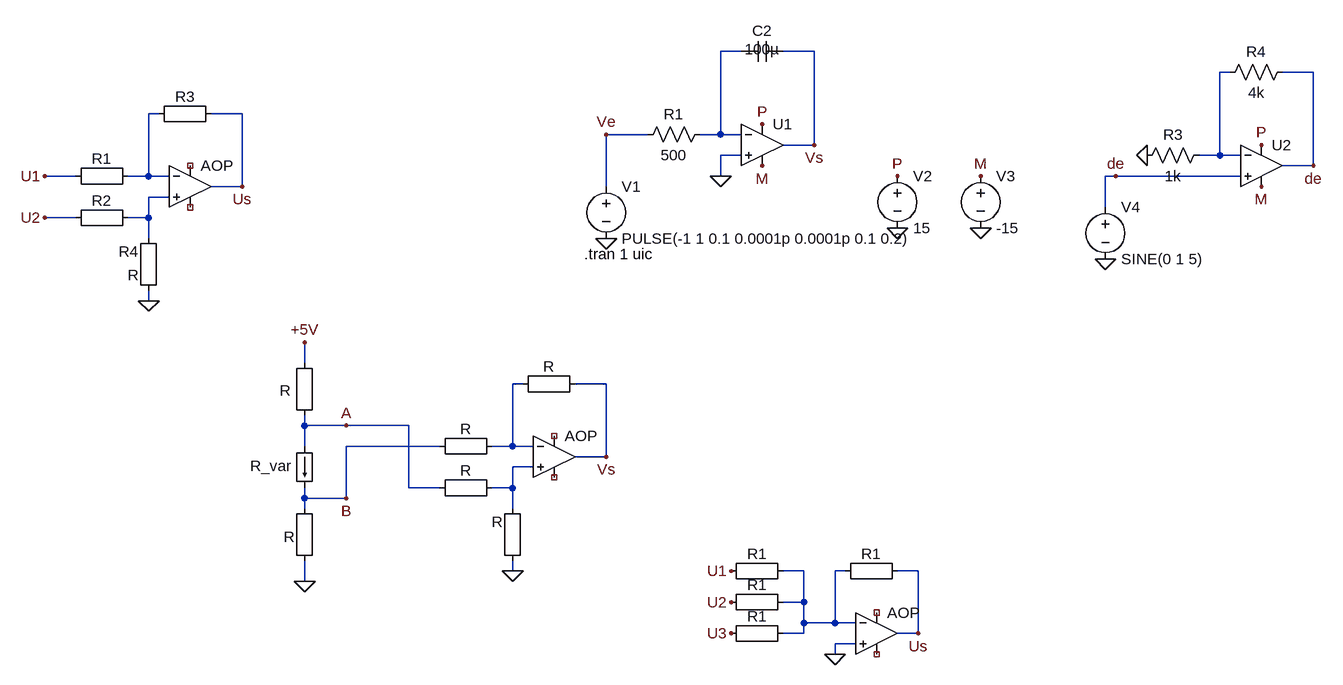
[diagram p0: schematic non_inv.asc]
non_inv.asc, the LTspice schematic file:
Version 4
SHEET 1 1008 908
WIRE 96 -48 64 -48
WIRE 208 -48 160 -48
WIRE 848 -16 832 -16
WIRE 976 -16 928 -16
WIRE -800 48 -816 48
WIRE -672 48 -720 48
WIRE -48 80 -112 80
WIRE 64 80 64 -48
WIRE 64 80 32 80
WIRE 96 80 64 80
WIRE 208 96 208 -48
WIRE 208 96 160 96
WIRE 96 112 64 112
WIRE 832 112 832 -16
WIRE 832 112 800 112
WIRE 864 112 832 112
WIRE 976 128 976 -16
WIRE 976 128 928 128
WIRE -928 144 -976 144
WIRE -816 144 -816 48
WIRE -816 144 -848 144
WIRE -784 144 -816 144
WIRE 64 144 64 112
WIRE 672 144 656 144
WIRE 864 144 672 144
WIRE -672 160 -672 48
WIRE -672 160 -720 160
WIRE -112 160 -112 80
WIRE -784 176 -816 176
WIRE 656 192 656 144
WIRE -928 208 -976 208
WIRE -816 208 -816 176
WIRE -816 208 -848 208
WIRE -816 240 -816 208
WIRE -816 336 -816 320
WIRE -576 432 -576 400
WIRE -240 464 -256 464
WIRE -112 464 -160 464
WIRE -576 528 -576 512
WIRE -512 528 -576 528
WIRE -416 528 -512 528
WIRE -576 560 -576 528
WIRE -368 560 -512 560
WIRE -256 560 -256 464
WIRE -256 560 -288 560
WIRE -224 560 -256 560
WIRE -112 576 -112 464
WIRE -112 576 -160 576
WIRE -224 592 -256 592
WIRE -416 624 -416 528
WIRE -368 624 -416 624
WIRE -256 624 -256 592
WIRE -256 624 -288 624
WIRE -576 640 -576 624
WIRE -512 640 -512 560
WIRE -512 640 -576 640
WIRE -576 656 -576 640
WIRE -256 656 -256 624
WIRE -256 752 -256 736
WIRE 192 752 160 752
WIRE 256 752 240 752
WIRE 368 752 336 752
WIRE -576 768 -576 736
WIRE 192 800 192 752
WIRE 192 800 160 800
WIRE 192 832 192 800
WIRE 240 832 240 752
WIRE 240 832 192 832
WIRE 272 832 240 832
WIRE 192 848 192 832
WIRE 192 848 160 848
WIRE 368 848 368 752
WIRE 368 848 336 848
WIRE 272 864 240 864
WIRE 240 880 240 864
FLAG 64 144 0
FLAG -112 240 0
FLAG 208 96 Vs
FLAG 336 224 0
FLAG 464 224 0
FLAG 336 144 P
FLAG 128 64 P
FLAG 464 144 M
FLAG 128 128 M
FLAG 656 272 0
FLAG 976 128 de
FLAG 896 96 P
FLAG 896 160 M
FLAG 720 112 0
FLAG 672 144 de
FLAG -112 80 Ve
FLAG -816 336 0
FLAG -976 144 U1
FLAG -976 208 U2
FLAG -672 160 Us
FLAG -576 768 0
FLAG -576 400 +5V
FLAG -512 528 A
FLAG -512 640 B
FLAG -256 752 0
FLAG -112 576 Vs
FLAG 80 752 U1
FLAG 80 800 U2
FLAG 80 848 U3
FLAG 240 880 0
FLAG 368 848 Us
SYMBOL Opamps\\UniversalOpamp2 128 96 R0
SYMATTR InstName U1
SYMBOL voltage -112 144 R0
WINDOW 123 0 0 Left 2
WINDOW 39 0 0 Left 2
SYMATTR InstName V1
SYMATTR Value PULSE(-1 1 0.1 0.0001p 0.0001p 0.1 0.2)
SYMBOL res 48 64 R90
WINDOW 0 0 56 VBottom 2
WINDOW 3 32 56 VTop 2
SYMATTR InstName R1
SYMATTR Value 500
SYMBOL voltage 336 128 R0
WINDOW 123 0 0 Left 2
WINDOW 39 0 0 Left 2
SYMATTR InstName V2
SYMATTR Value 15
SYMBOL voltage 464 128 R0
WINDOW 123 0 0 Left 2
WINDOW 39 0 0 Left 2
SYMATTR InstName V3
SYMATTR Value -15
SYMBOL Opamps\\UniversalOpamp2 896 128 R0
SYMATTR InstName U2
SYMBOL voltage 656 176 R0
WINDOW 123 0 0 Left 2
WINDOW 39 0 0 Left 2
SYMATTR InstName V4
SYMATTR Value SINE(0 1 5)
SYMBOL res 816 96 R90
WINDOW 0 0 56 VBottom 2
WINDOW 3 32 56 VTop 2
SYMATTR InstName R3
SYMATTR Value 1k
SYMBOL res 944 -32 R90
WINDOW 0 0 56 VBottom 2
WINDOW 3 32 56 VTop 2
SYMATTR InstName R4
SYMATTR Value 4k
SYMBOL cap 160 -64 R90
WINDOW 0 0 32 VBottom 2
WINDOW 3 28 32 VBottom 2
SYMATTR InstName C2
SYMATTR Value 100µ
SYMBOL Opamps\\UniversalOpamp2 -752 160 R0
SYMATTR InstName AOP
SYMBOL Misc\\EuropeanResistor -704 32 R90
WINDOW 0 5 56 VBottom 2
WINDOW 3 27 56 VTop 2
SYMATTR InstName R3
SYMATTR Value ""
SYMBOL Misc\\EuropeanResistor -832 128 R90
WINDOW 0 5 56 VBottom 2
WINDOW 3 27 56 VTop 2
SYMATTR InstName R1
SYMATTR Value ""
SYMBOL Misc\\EuropeanResistor -832 192 R90
WINDOW 0 5 56 VBottom 2
WINDOW 3 27 56 VTop 2
SYMATTR InstName R2
SYMATTR Value ""
SYMBOL Misc\\EuropeanResistor -800 336 R180
WINDOW 0 31 76 Left 2
WINDOW 3 31 40 Left 2
SYMATTR InstName R4
SYMBOL Misc\\EuropeanResistor -560 528 R180
WINDOW 0 37 54 Left 2
WINDOW 3 31 40 Left 2
SYMATTR InstName R
SYMATTR Value ""
SYMBOL Misc\\EuropeanResistor -560 752 R180
WINDOW 0 31 53 Left 2
WINDOW 3 31 40 Left 2
SYMATTR InstName R
SYMATTR Value ""
SYMBOL load -592 560 R0
WINDOW 0 -68 30 Left 2
SYMATTR InstName R_var
SYMATTR Value ""
SYMBOL Opamps\\UniversalOpamp2 -192 576 R0
SYMATTR InstName AOP
SYMBOL Misc\\EuropeanResistor -144 448 R90
WINDOW 0 5 56 VBottom 2
WINDOW 3 27 56 VTop 2
SYMATTR InstName R
SYMATTR Value ""
SYMBOL Misc\\EuropeanResistor -272 544 R90
WINDOW 0 5 56 VBottom 2
WINDOW 3 27 56 VTop 2
SYMATTR InstName R
SYMATTR Value ""
SYMBOL Misc\\EuropeanResistor -272 608 R90
WINDOW 0 5 56 VBottom 2
WINDOW 3 27 56 VTop 2
SYMATTR InstName R
SYMATTR Value ""
SYMBOL Misc\\EuropeanResistor -240 752 R180
WINDOW 0 31 76 Left 2
WINDOW 3 31 40 Left 2
SYMATTR InstName R
SYMATTR Value ""
SYMBOL Opamps\\UniversalOpamp2 304 848 R0
SYMATTR InstName AOP
SYMBOL Misc\\EuropeanResistor 176 736 R90
WINDOW 0 5 56 VBottom 2
WINDOW 3 27 56 VTop 2
SYMATTR InstName R1
SYMATTR Value ""
SYMBOL Misc\\EuropeanResistor 176 784 R90
WINDOW 0 5 56 VBottom 2
WINDOW 3 27 56 VTop 2
SYMATTR InstName R1
SYMATTR Value ""
SYMBOL Misc\\EuropeanResistor 176 832 R90
WINDOW 0 5 56 VBottom 2
WINDOW 3 27 56 VTop 2
SYMATTR InstName R1
SYMATTR Value ""
SYMBOL Misc\\EuropeanResistor 352 736 R90
WINDOW 0 5 56 VBottom 2
WINDOW 3 27 56 VTop 2
SYMATTR InstName R1
SYMATTR Value ""
TEXT -146 264 Left 2 !.tran 1 uic

The netlist it stands for:
* non_inv.asc
XU1 0 N001 P M Vs level.2 Avol=1Meg GBW=10Meg Slew=10Meg ilimit=25m rail=0 Vos=0 phimargin=45 en=0 enk=0 in=0 ink=0 Rin=500Meg  ; pins IN+ IN- V+ V- OUT
V1 Ve 0 PULSE(-1 1 0.1 0.0001p 0.0001p 0.1 0.2)
R1 N001 Ve 500
V2 P 0 15
V3 M 0 -15
XU2 de N002 P M de level.2 Avol=1Meg GBW=10Meg Slew=10Meg ilimit=25m rail=0 Vos=0 phimargin=45 en=0 enk=0 in=0 ink=0 Rin=500Meg  ; pins IN+ IN- V+ V- OUT
V4 de 0 SINE(0 1 5)
R3 N002 0 1k
R4 de N002 4k
C2 Vs N001 100µ
XAOP N004 N003 NC_01 NC_02 Us level.2 Avol=1Meg GBW=10Meg Slew=10Meg ilimit=25m rail=0 Vos=0 phimargin=45 en=0 enk=0 in=0 ink=0 Rin=500Meg  ; pins IN+ IN- V+ V- OUT
R3 Us N003
R1 N003 U1
R2 N004 U2
R4 0 N004 R
R A +5V
R 0 B
I§R_var A B
XAOP N006 N005 NC_03 NC_04 Vs level.2 Avol=1Meg GBW=10Meg Slew=10Meg ilimit=25m rail=0 Vos=0 phimargin=45 en=0 enk=0 in=0 ink=0 Rin=500Meg  ; pins IN+ IN- V+ V- OUT
R Vs N005
R N005 B
R N006 A
R 0 N006
XAOP 0 N007 NC_05 NC_06 Us level.2 Avol=1Meg GBW=10Meg Slew=10Meg ilimit=25m rail=0 Vos=0 phimargin=45 en=0 enk=0 in=0 ink=0 Rin=500Meg  ; pins IN+ IN- V+ V- OUT
R1 N007 U1
R1 N007 U2
R1 N007 U3
R1 Us N007
.tran 1 uic
.lib UniversalOpamps2.sub
.backanno
.end